# EasyEDA Pro project head_board.epro, schematic Schematic1
Board Name: Board1; Create Date: 2026-06-08; Page Name: P1; Project Name: AZIMOV Head; Schematic Name: Schematic1; Update Date: 2026-06-18; Company: EasyEDA.com; Page Size: A4; Version: V1.0
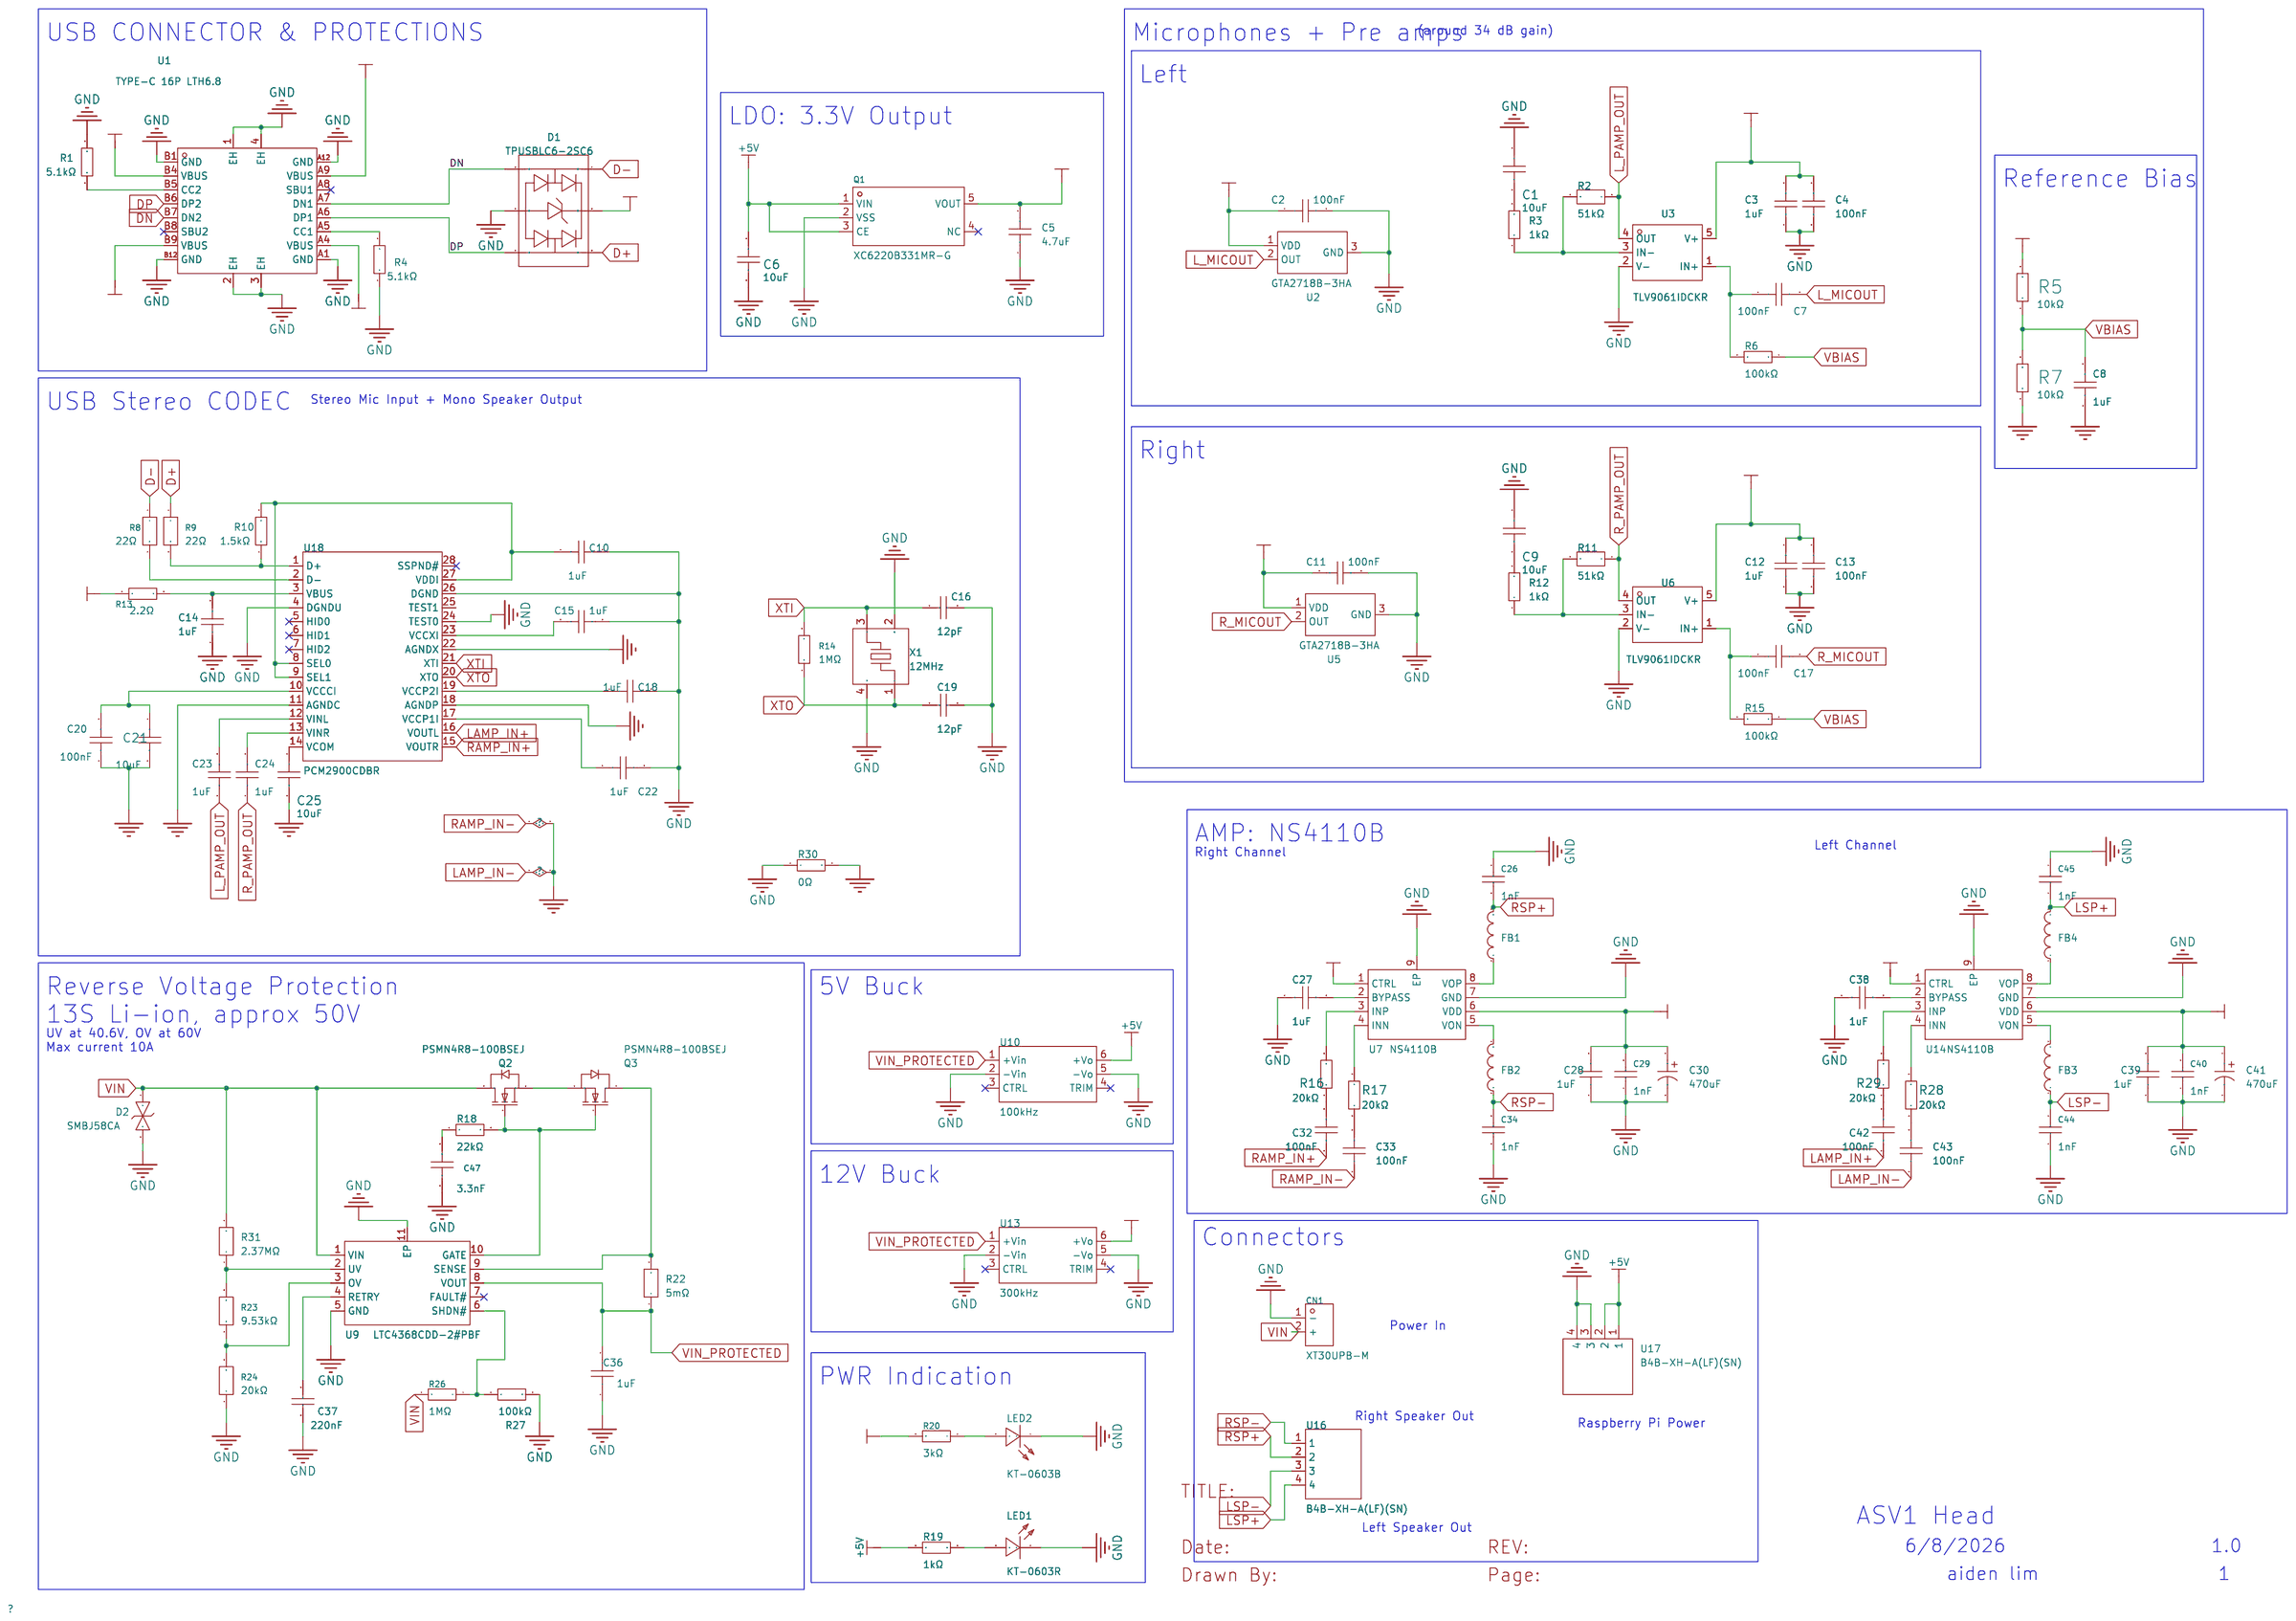
[diagram p0: schematic sheet]

## Parts
C1  10uF  [C0603]
C2  100nF  [C0603]
C3  1uF  [C0603]
C4  100nF  [C0603]
C5  4.7uF  [C0603]
C6  10uF  [C0603]
C7  100nF  [C0603]
C8  1uF  [C0603]
C9  10uF  [C0603]
C10  1uF  [C0603]
C11  100nF  [C0603]
C12  1uF  [C0603]
C13  100nF  [C0603]
C14  1uF  [C0603]
C15  1uF  [C0603]
C16  12pF  [C0603]
C17  100nF  [C0603]
C18  1uF  [C0603]
C19  12pF  [C0603]
C20  100nF  [C0603]
C21  10uF  [C0603]
C22  1uF  [C0603]
C23  1uF  [C0603]
C24  1uF  [C0603]
C25  10uF  [C0603]
C26  1nF  [C0603]
C27  1uF  [C0603]
C28  1uF  [C0603]
C29  1nF  [C0603]
C30  470uF  [CAP-TH_BD10.0-P5.00-D1.0-FD]
C32  100nF  [C0603]
C33  100nF  [C0603]
C34  1nF  [C0603]
C36  1uF  [C1206]
C37  220nF  [C0603]
C38  1uF  [C0603]
C39  1uF  [C0603]
C40  1nF  [C0603]
C41  470uF  [CAP-TH_BD10.0-P5.00-D1.0-FD]
C42  100nF  [C0603]
C43  100nF  [C0603]
C44  1nF  [C0603]
C45  1nF  [C0603]
C47  3.3nF  [C0603]
CN1  XT30UPB-M  [CONN-TH_XT30UPB-M]
D1  TPUSBLC6-2SC6  [SOT-23-6_L2.9-W1.6-P0.95-LS2.8-BR]
D2  SMBJ58CA  [SMB_L4.6-W3.6-LS5.4-BI]
FB1  BLM31PG601SN1L  [L1206]
FB2  BLM31PG601SN1L  [L1206]
FB3  BLM31PG601SN1L  [L1206]
FB4  BLM31PG601SN1L  [L1206]
LED1  KT-0603R  [LED0603-RD]
LED2  KT-0603B  [LED0603-RD]
Q1  XC6220B331MR-G  [SOT-25_L3.0-W1.6-P0.95-LS2.8-TL]
Q2  PSMN4R8-100BSEJ  [SOT404_L11.0-W10.0-P2.54-LS15.3-BR]
Q3  PSMN4R8-100BSEJ  [SOT404_L11.0-W10.0-P2.54-LS15.3-BR]
R1  5.1kΩ  [R0603]
R2  51kΩ  [R0603]
R3  1kΩ  [R0603]
R4  5.1kΩ  [R0603]
R5  10kΩ  [R0603]
R6  100kΩ  [R0603]
R7  10kΩ  [R0603]
R8  22Ω  [R0603]
R9  22Ω  [R0603]
R10  1.5kΩ  [R0603]
R11  51kΩ  [R0603]
R12  1kΩ  [R0603]
R13  2.2Ω  [R0603]
R14  1MΩ  [R0603]
R15  100kΩ  [R0603]
R16  20kΩ  [R0603]
R17  20kΩ  [R0603]
R18  22kΩ  [R0603]
R19  1kΩ  [R0603]
R20  3kΩ  [R0603]
R22  5mΩ  [RES-SMD_L6.4-W3.2_LR2512D-3W-1MR]
R23  9.53kΩ  [R0603]
R24  20kΩ  [R0805]
R26  1MΩ  [R0603]
R27  100kΩ  [R0603]
R28  20kΩ  [R0603]
R29  20kΩ  [R0603]
R30  0Ω  [R0603]
R31  2.37MΩ  [R0603]
U1  TYPE-C 16P LTH6.8  [USB-C-SMD_TYPE-C-16P-LTH6.8]
U2  GTA2718B-3HA  [MIC-SMD_3P-L2.8-W1.9_AP1688]
U3  TLV9061IDCKR  [SC-70-5_L2.1-W1.3-P0.65-LS2.2-BR]
U5  GTA2718B-3HA  [MIC-SMD_3P-L2.8-W1.9_AP1688]
U6  TLV9061IDCKR  [SC-70-5_L2.1-W1.3-P0.65-LS2.2-BR]
U7  NS4110B  [ESOP-8_L4.9-W3.9-P1.27-LS6.0-BL-EP-1]
U9  LTC4368CDD-2#PBF  [DFN-10_L3.0-W3.0-P0.50-BL-EP]
U10  100kHz  [PWRM-TH_TURBXXXXLD-30WR3]
U13  300kHz  [PWRM-TH_TURBXXXXLD-30WR3]
U14  NS4110B  [ESOP-8_L4.9-W3.9-P1.27-LS6.0-BL-EP-1]
U16  B4B-XH-A(LF)(SN)  [CONN-TH_B4B-XH-A-LF-SN]
U17  B4B-XH-A(LF)(SN)  [CONN-TH_B4B-XH-A-LF-SN]
U18  PCM2900CDBR  [SSOP-28_L10.2-W5.3-P0.65-LS7.8-BL]
X1  12MHz  [CRYSTAL-SMD_4P-L2.5-W2.0-BL-2]

## Library data of the parts
C1 C6 C9 C21 C25 = CL10A106MA8NRNC: Capacitance:10uF Tolerance:±20% Tolerance:±20% Voltage Rating:25V Temperature Coefficient:X5R; LCSC Part Name: 10uF ±20% 25V; Supplier Part: C96446; Manufacturer: SAMSUNG(三星); Supplier Footprint: 0603; JLCPCB Part Class: Basic Part; Datasheet: https://item.szlcsc.com/datasheet/CL10A106MA8NRNC/97651.html; Supplier: LCSC; Tolerance: ±20%; Voltage Rating: 25V; Temperature Coefficient: X5R
C2 C4 C7 C11 C13 C17 C20 C32 C33 C42 C43 = CC0603KRX7R9BB104: Capacitance:100nF Tolerance:±10% Tolerance:±10% Voltage Rating:50V Temperature Coefficient:X7R; LCSC Part Name: 100nF ±10% 50V; Supplier Part: C14663; Manufacturer: YAGEO(国巨); Supplier Footprint: 0603; JLCPCB Part Class: Basic Part; Datasheet: https://item.szlcsc.com/datasheet/CC0603KRX7R9BB104/15331.html; Supplier: LCSC; Tolerance: ±10%; Voltage Rating: 50V; Temperature Coefficient: X7R
C3 C8 C10 C12 C14 C15 C18 C22-C24 C27 C28 C38 C39 = CL10A105KB8NNNC: Capacitance:1uF Tolerance:±10% Tolerance:±10% Voltage Rating:50V Temperature Coefficient:X5R; LCSC Part Name: 1uF ±10% 50V; Supplier Part: C15849; Manufacturer: SAMSUNG(三星); Supplier Footprint: 0603; JLCPCB Part Class: Basic Part; Datasheet: https://item.szlcsc.com/datasheet/CL10A105KB8NNNC/16531.html; Supplier: LCSC; Tolerance: ±10%; Voltage Rating: 50V; Temperature Coefficient: X5R
C5 = CL10A475KO8NNNC: Capacitance:4.7uF Tolerance:±10% Tolerance:±10% Voltage Rating:16V Temperature Coefficient:X5R; LCSC Part Name: 4.7uF ±10% 16V; Supplier Part: C19666; Manufacturer: SAMSUNG(三星); Supplier Footprint: 0603; JLCPCB Part Class: Basic Part; Datasheet: https://item.szlcsc.com/datasheet/CL10A475KO8NNNC/20375.html; Supplier: LCSC; Tolerance: ±10%; Voltage Rating: 16V; Temperature Coefficient: X5R
C16 C19 = CL10C120JB8NNNC: Capacitance:12pF Tolerance:±5% Tolerance:±5% Voltage Rating:50V Temperature Coefficient:C0G; LCSC Part Name: 12pF ±5% 50V; Supplier Part: C38523; Manufacturer: SAMSUNG(三星); Supplier Footprint: 0603; JLCPCB Part Class: Basic Part; Datasheet: https://item.szlcsc.com/datasheet/CL10C120JB8NNNC/39506.html; Supplier: LCSC; Tolerance: ±5%; Voltage Rating: 50V; Temperature Coefficient: C0G
C26 C29 C34 C40 C44 C45 = CL10B102KB8NNNC: Capacitance:1nF Tolerance:±10% Tolerance:±10% Voltage Rating:50V Temperature Coefficient:X7R; LCSC Part Name: 1nF ±10% 50V; Supplier Part: C1588; Manufacturer: SAMSUNG(三星); Supplier Footprint: 0603; Datasheet: https://item.szlcsc.com/datasheet/CL10B102KB8NNNC/1940.html; Supplier: LCSC; Tolerance: ±10%; Voltage Rating: 50V; Temperature Coefficient: X7R
C30 C41 = KM477M035G17RR0VH2FP0: Capacitance:470uF Tolerance:±20% Tolerance:±20% Voltage Rating:35V Pin Spacing:5mm Diameter:10mm Height - Seated (Max):17mm Lifetime:2000hrs@105℃; LCSC Part Name: 470uF ±20% 35V; Supplier Part: C2064; Manufacturer: Chengx(承兴); Supplier Footprint: 插件,D10xL17mm; JLCPCB Part Class: Extended Part; Datasheet: https://item.szlcsc.com/datasheet/KM477M035G17RR0VH2FP0/2416.html; Supplier: LCSC; Tolerance: ±20%; Voltage Rating: 35V; Pin Spacing: 5mm; Diameter: 10mm; Height - Seated (Max): 17mm; Lifetime: 2000hrs@105℃
C36 = CC1206KKX7R0BB105: Capacitance:1uF Tolerance:±10% Tolerance:±10% Voltage Rating:100V Temperature Coefficient:X7R; LCSC Part Name: 1uF ±10% 100V; Supplier Part: C70463; Manufacturer: YAGEO(国巨); Supplier Footprint: 1206; Datasheet: https://item.szlcsc.com/datasheet/CC1206KKX7R0BB105/71560.html; Supplier: LCSC; Tolerance: ±10%; Voltage Rating: 100V; Temperature Coefficient: X7R
C37 = CL10B224KA8NNNC: Capacitance:220nF Tolerance:±10% Tolerance:±10% Voltage Rating:25V Temperature Coefficient:X7R; LCSC Part Name: 220nF ±10% 25V; Supplier Part: C21120; Manufacturer: SAMSUNG(三星); Supplier Footprint: 0603; JLCPCB Part Class: Basic Part; Datasheet: https://item.szlcsc.com/datasheet/CL10B224KA8NNNC/21832.html; Supplier: LCSC; Tolerance: ±10%; Voltage Rating: 25V; Temperature Coefficient: X7R
C47 = 0603B332K101CT: Capacitance:3.3nF Tolerance:±10% Tolerance:±10% Voltage Rating:100V Temperature Coefficient:X7R; LCSC Part Name: 3.3nF ±10% 100V; Supplier Part: C388015; Manufacturer: Walsin(华新科); Supplier Footprint: 0603; JLCPCB Part Class: Extended Part; Datasheet: https://item.szlcsc.com/datasheet/0603B332K101CT/362276.html; Supplier: LCSC; Tolerance: ±10%; Voltage Rating: 100V; Temperature Coefficient: X7R
CN1 = XT30UPB-M: Rated current:15A Rated voltage: colour:Yellow Connector type:Model aircraft plug contact resistance: interface form:Male insulating material: metal material:Gold plating; LCSC Part Name: AMASS(艾迈斯)板载立式 航模锂电池控制器连接器插头 PCB板立式 公头XT30UPB-M.G.Y; Supplier Part: C428721; Manufacturer: AMASS(艾迈斯); JLCPCB Part Class: Extended Part; Datasheet: https://item.szlcsc.com/datasheet/XT30UPB-M/423831.html; Supplier: LCSC; Rated current: 15A; colour: Yellow; Connector type: Model aircraft plug; interface form: Male; metal material: Gold plating
D1 = TPUSBLC6-2SC6: Supplier Part: C558442; Manufacturer: TECH PUBLIC(台舟); Supplier Footprint: SOT-23-6; JLCPCB Part Class: Extended Part; Datasheet: https://atta.szlcsc.com/upload/public/pdf/source/20210810/11DFA42F7286E2AE9C51365C4E40A67A.pdf; Supplier: LCSC
D2 = SMBJ58CA_C19077592: Polarity:Bidirectional Reverse Stand-Off Voltage (Vrwm):58V Clamping Voltage:93.6V Peak Pulse Current (Ipp):6.41A@10/1000us Peak Pulse Power Dissipation (Ppp):600W@10/1000us Voltage - Breakdown:71.2V Reverse Leakage Current (Ir):5uA Operating Temperature:; LCSC Part Name: 双向TVS 58V截止 峰值浪涌电流：6.41A@10/1000us; Supplier Part: C19077592; Manufacturer: R+O(宏嘉诚); Supplier Footprint: DO-214AA(SMB); Datasheet: https://item.szlcsc.com/datasheet/SMBJ58CA/20275677.html; Supplier: LCSC; Polarity: Bidirectional; Reverse Stand-Off Voltage (Vrwm): 58V; Clamping Voltage: 93.6V; Peak Pulse Current (Ipp): 6.41A@10/1000us; Peak Pulse Power Dissipation (Ppp): 600W@10/1000us; Voltage - Breakdown: 71.2V; Reverse Leakage Current (Ir): 5uA; Operating Temperature: -55℃~+150℃; level of protection: IEC 61000-4-2; Type: TVS
FB1-FB4 = BLM31PG601SN1L: Impedance @ Frequency:600Ω@100MHz Tolerance:±25% Tolerance:±25% DC Resistance(DCR):80mΩ Current Rating:1.5A Number of Circuits:1 Operating Temperature:-55℃~+125℃ Operating Temperature:-55℃~+125℃; LCSC Part Name: 单路 1206磁珠 阻抗600Ω@100MHz; Supplier Part: C16902; Manufacturer: muRata(村田); Supplier Footprint: 1206; JLCPCB Part Class: Extended Part; Datasheet: https://item.szlcsc.com/datasheet/BLM31PG601SN1L/17586.html; Supplier: LCSC; Impedance @ Frequency: 600Ω@100MHz; Tolerance: ±25%; DC Resistance(DCR): 80mΩ; Current Rating: 1.5A; Number of Circuits: 1; Operating Temperature: -55℃~+125℃
LED1 = KT-0603R: Emitted Color:Red Power Dissipation:- Forward Current:- Dominant Wavelength:- Dominant Wavelength:- Peak Wavelength:- Diode Configuration:- Lens Color:- Color Temperature:- Color Temperature:- Viewing Angle:- Mounting Sytle:- Operating Temperature:-40℃~+8; LCSC Part Name: 0603 红灯 高亮; Supplier Part: C2286; Manufacturer: KENTO; Supplier Footprint: 0603; JLCPCB Part Class: Basic Part; Datasheet: https://atta.szlcsc.com/upload/public/pdf/source/20160616/1466072038404.pdf; Supplier: LCSC; Emitted Color: Red; Operating Temperature: -40℃~+85℃
LED2 = KT-0603B: Lamp Holder Type:1.6mm x 0.8mm square LED Illumination Color:Blue Voltage - Forward(Vf):3.1V Voltage - Forward(Vf):3.1V Power(Watts):100mW Forward Current:5mA Wavelength - Dominant:460nm~475nm Wavelength - Dominant:460nm~475nm Peak Wavelength:469nm Peak W; LCSC Part Name: 0603 蓝灯 高亮; Supplier Part: C2288; Manufacturer: KENTO; Supplier Footprint: 0603; Datasheet: https://item.szlcsc.com/datasheet/KT-0603B/2661.html; Supplier: LCSC; Lamp Holder Type: 1.6mm x 0.8mm square LED; Illumination Color: Blue; Voltage - Forward(Vf): 3.1V; Power(Watts): 100mW; Forward Current: 5mA; Wavelength - Dominant: 460nm~475nm; Peak Wavelength: 469nm; Diode Configuration: Discrete Diode; Lens Color: Water Clear; Luminous Intensity: 175mcd; Viewing Angle: 120°; Operating Temperature: -40℃~+85℃
Q1 = XC6220B331MR-G: Output Type:Fixed Voltage - Supply:6V Output Voltage:3.3V Output Voltage:3.3V Output Current:1A Power Supply Rejection Ratio (PSRR):50dB@(1kHz) Voltage Dropout:655mV@(1A) standby current:8uA Features:Over Current Protection；Enable；Over Temperature Protect; LCSC Part Name: 输入6V 输出3.3V 1A 带\"GO\"功能的高速LDO电压稳压器; Supplier Part: C86534; Manufacturer: TOREX(特瑞仕); Supplier Footprint: SOT-25; JLCPCB Part Class: Extended Part; Datasheet: https://item.szlcsc.com/datasheet/XC6220B331MR-G/87711.html; Supplier: LCSC; Output Type: Fixed; Voltage - Supply: 6V; Output Voltage: 3.3V; Output Current: 1A; Power Supply Rejection Ratio (PSRR): 50dB@(1kHz); Voltage Dropout: 655mV@(1A); standby current: 8uA; Features: Over Current Protection；Enable；Over Temperature Protection；Short Circuit Protection; Operating Temperature: -40℃~+85℃; Output Configuration: Positive; Number of Outputs: 1
Q2 Q3 = PSMN4R8-100BSEJ_C458260: Number:1 N-Channel Drain to Source Voltage:100V Current - Continuous Drain(Id):120A RDS(on):4.8mΩ@10V,25A Pd - Power Dissipation:405W Gate Threshold Voltage (Vgs(th)):3V Gate Charge(Qg):278nC@10V Input Capacitance(Ciss):14.4nF@50V Reverse Transfer Capacit; LCSC Part Name: 1个N沟道 耐压:100V 电流:120A; Supplier Part: C458260; Manufacturer: Nexperia(安世); Supplier Footprint: D2PAK; JLCPCB Part Class: Extended Part; Datasheet: https://item.szlcsc.com/datasheet/PSMN4R8-100BSEJ/462079.html; Supplier: LCSC; Number: 1 N-Channel; Drain to Source Voltage: 100V; Current - Continuous Drain(Id): 120A; RDS(on): 4.8mΩ@10V,25A; Pd - Power Dissipation: 405W; Gate Threshold Voltage (Vgs(th)): 3V; Gate Charge(Qg): 278nC@10V; Input Capacitance(Ciss): 14.4nF@50V; Reverse Transfer Capacitance (Crss@Vds): 643pF@50V; Operating Temperature: -55℃~+175℃
R1 R4 = 0603WAF5101T5E: Type:Thick Film Resistor Resistance:5.1kΩ Tolerance:±1% Tolerance:±1% Power(Watts):100mW Voltage-Supply(Max):75V Temperature Coefficient:±100ppm/℃ Temperature Coefficient:±100ppm/℃ Operating Temperature:-55℃~+155℃ Operating Temperature:-55℃~+155℃; LCSC Part Name: 5.1kΩ ±1% 100mW 厚膜电阻; Supplier Part: C23186; Manufacturer: UNI-ROYAL(厚声); Supplier Footprint: 0603; JLCPCB Part Class: Basic Part; Datasheet: https://item.szlcsc.com/datasheet/0603WAF5101T5E/23913.html; Supplier: LCSC; Type: Thick Film Resistor; Tolerance: ±1%; Power(Watts): 100mW; Voltage-Supply(Max): 75V; Temperature Coefficient: ±100ppm/℃; Operating Temperature: -55℃~+155℃
R2 R11 = CR0603F51K0P05Z: Type:Thick Film Resistor Resistance:51kΩ Tolerance:±1% Tolerance:±1% Power(Watts):100mW Voltage-Supply(Max):75V Temperature Coefficient:±100ppm/℃ Temperature Coefficient:±100ppm/℃ Operating Temperature:-55℃~+155℃ Operating Temperature:-55℃~+155℃; LCSC Part Name: 厚膜电阻 51kΩ ±1% 100mW; Supplier Part: C881264; Manufacturer: EVER OHMS(天二科技); Supplier Footprint: 0603; JLCPCB Part Class: Extended Part; Datasheet: https://item.szlcsc.com/datasheet/CR0603F51K0P05Z/944179.html; Supplier: LCSC; Type: Thick Film Resistor; Tolerance: ±1%; Power(Watts): 100mW; Voltage-Supply(Max): 75V; Temperature Coefficient: ±100ppm/℃; Operating Temperature: -55℃~+155℃
R3 R12 = 0603WAF1001T5E: Type:Thick Film Resistor Resistance:1kΩ Tolerance:±1% Tolerance:±1% Power(Watts):100mW Voltage-Supply(Max):75V Temperature Coefficient:±100ppm/℃ Temperature Coefficient:±100ppm/℃ Operating Temperature:-55℃~+155℃ Operating Temperature:-55℃~+155℃; LCSC Part Name: 1kΩ ±1% 100mW 厚膜电阻; Supplier Part: C21190; Manufacturer: UNI-ROYAL(厚声); Supplier Footprint: 0603; Datasheet: https://item.szlcsc.com/datasheet/0603WAF1001T5E/21904.html; Supplier: LCSC; Type: Thick Film Resistor; Tolerance: ±1%; Power(Watts): 100mW; Voltage-Supply(Max): 75V; Temperature Coefficient: ±100ppm/℃; Operating Temperature: -55℃~+155℃
R5 R7 = RT0603BRD0710KL: Type:Thin Film Resistor Resistance:10kΩ Tolerance:±0.1% Tolerance:±0.1% Power(Watts):100mW Voltage-Supply(Max):75V Temperature Coefficient:±25ppm/℃ Temperature Coefficient:±25ppm/℃ Operating Temperature:-55℃~+155℃ Operating Temperature:-55℃~+155℃; LCSC Part Name: 薄膜电阻 10kΩ ±0.1% 100mW; Supplier Part: C95204; Manufacturer: YAGEO(国巨); Supplier Footprint: 0603; JLCPCB Part Class: Extended Part; Datasheet: https://item.szlcsc.com/datasheet/RT0603BRD0710KL/96405.html; Supplier: LCSC; Type: Thin Film Resistor; Tolerance: ±0.1%; Power(Watts): 100mW; Voltage-Supply(Max): 75V; Temperature Coefficient: ±25ppm/℃; Operating Temperature: -55℃~+155℃
R6 R15 R27 = 0603WAF1003T5E: Type:Thick Film Resistor Resistance:100kΩ Tolerance:±1% Tolerance:±1% Power(Watts):100mW Voltage-Supply(Max):75V Temperature Coefficient:±100ppm/℃ Temperature Coefficient:±100ppm/℃ Operating Temperature:-55℃~+155℃ Operating Temperature:-55℃~+155℃; LCSC Part Name: 100kΩ ±1% 100mW 厚膜电阻; Supplier Part: C25803; Manufacturer: UNI-ROYAL(厚声); Supplier Footprint: 0603; JLCPCB Part Class: Basic Part; Datasheet: https://item.szlcsc.com/datasheet/0603WAF1003T5E/26546.html; Supplier: LCSC; Type: Thick Film Resistor; Tolerance: ±1%; Power(Watts): 100mW; Voltage-Supply(Max): 75V; Temperature Coefficient: ±100ppm/℃; Operating Temperature: -55℃~+155℃
R8 R9 = ERJPA3J220V: Type:Thick Film Resistors Resistance: Tolerance:±5% Tolerance:±5% Power(Watts):333mW Overload Voltage (Max):- Temperature Coefficient:±200ppm/℃ Temperature Coefficient:±200ppm/℃ Operating Temperature Range:-55℃~+155℃ Operating Temperature Range:-55℃~+155℃; LCSC Part Name: 22Ω ±5% 333mW 厚膜电阻; Supplier Part: C441880; Manufacturer: PANASONIC(松下); Supplier Footprint: 0603; JLCPCB Part Class: Extended Part; Supplier: LCSC; Type: Thick Film Resistors; Tolerance: ±5%; Power(Watts): 333mW; Temperature Coefficient: ±200ppm/℃; Operating Temperature Range: -55℃~+155℃
R10 = 0603WAF1501T5E: Type:Thick Film Resistor Resistance:1.5kΩ Tolerance:±1% Tolerance:±1% Power(Watts):100mW Voltage-Supply(Max):75V Temperature Coefficient:±100ppm/℃ Temperature Coefficient:±100ppm/℃ Operating Temperature:-55℃~+155℃ Operating Temperature:-55℃~+155℃; LCSC Part Name: 1.5kΩ ±1% 100mW 厚膜电阻; Supplier Part: C22843; Manufacturer: UNI-ROYAL(厚声); Supplier Footprint: 0603; Datasheet: https://item.szlcsc.com/datasheet/0603WAF1501T5E/23570.html; Supplier: LCSC; Type: Thick Film Resistor; Tolerance: ±1%; Power(Watts): 100mW; Voltage-Supply(Max): 75V; Temperature Coefficient: ±100ppm/℃; Operating Temperature: -55℃~+155℃
R13 = 0603WAF220KT5E: Type:Thick Film Resistor Resistance:2.2Ω Tolerance:±1% Tolerance:±1% Power(Watts):100mW Voltage-Supply(Max):75V Temperature Coefficient:±400ppm/℃ Temperature Coefficient:±400ppm/℃ Operating Temperature:-55℃~+155℃ Operating Temperature:-55℃~+155℃; LCSC Part Name: 2.2Ω ±1% 100mW 厚膜电阻; Supplier Part: C22939; Manufacturer: UNI-ROYAL(厚声); Supplier Footprint: 0603; Datasheet: https://item.szlcsc.com/datasheet/0603WAF220KT5E/23666.html; Supplier: LCSC; Type: Thick Film Resistor; Tolerance: ±1%; Power(Watts): 100mW; Voltage-Supply(Max): 75V; Temperature Coefficient: ±400ppm/℃; Operating Temperature: -55℃~+155℃
R14 R26 = 0603WAF1004T5E: Type:Thick Film Resistor Resistance:1MΩ Tolerance:±1% Tolerance:±1% Power(Watts):100mW Voltage-Supply(Max):75V Temperature Coefficient:±100ppm/℃ Temperature Coefficient:±100ppm/℃ Operating Temperature:-55℃~+155℃ Operating Temperature:-55℃~+155℃; LCSC Part Name: 1MΩ ±1% 100mW 厚膜电阻; Supplier Part: C22935; Manufacturer: UNI-ROYAL(厚声); Supplier Footprint: 0603; JLCPCB Part Class: Basic Part; Datasheet: https://item.szlcsc.com/datasheet/0603WAF1004T5E/23662.html; Supplier: LCSC; Type: Thick Film Resistor; Tolerance: ±1%; Power(Watts): 100mW; Voltage-Supply(Max): 75V; Temperature Coefficient: ±100ppm/℃; Operating Temperature: -55℃~+155℃
R16 R17 R28 R29 = 0603WAF2002T5E: Type:Thick Film Resistor Resistance:20kΩ Tolerance:±1% Tolerance:±1% Power(Watts):100mW Voltage-Supply(Max):75V Temperature Coefficient:±100ppm/℃ Temperature Coefficient:±100ppm/℃ Operating Temperature:-55℃~+155℃ Operating Temperature:-55℃~+155℃; LCSC Part Name: 20kΩ ±1% 100mW 厚膜电阻; Supplier Part: C4184; Manufacturer: UNI-ROYAL(厚声); Supplier Footprint: 0603; JLCPCB Part Class: Basic Part; Datasheet: https://item.szlcsc.com/datasheet/0603WAF2002T5E/4591.html; Supplier: LCSC; Type: Thick Film Resistor; Tolerance: ±1%; Power(Watts): 100mW; Voltage-Supply(Max): 75V; Temperature Coefficient: ±100ppm/℃; Operating Temperature: -55℃~+155℃
R18 = 0603WAF2202T5E: Type:Thick Film Resistor Resistance:22kΩ Tolerance:±1% Tolerance:±1% Power(Watts):100mW Voltage-Supply(Max):75V Temperature Coefficient:±100ppm/℃ Temperature Coefficient:±100ppm/℃ Operating Temperature:-55℃~+155℃ Operating Temperature:-55℃~+155℃; LCSC Part Name: 22kΩ ±1% 100mW 厚膜电阻; Supplier Part: C31850; Manufacturer: UNI-ROYAL(厚声); Supplier Footprint: 0603; JLCPCB Part Class: Basic Part; Datasheet: https://item.szlcsc.com/datasheet/0603WAF2202T5E/32812.html; Supplier: LCSC; Type: Thick Film Resistor; Tolerance: ±1%; Power(Watts): 100mW; Voltage-Supply(Max): 75V; Temperature Coefficient: ±100ppm/℃; Operating Temperature: -55℃~+155℃
R19 = 0603WAF1001T5E: Type:Thick Film Resistor Resistance:1kΩ Tolerance:±1% Tolerance:±1% Power(Watts):100mW Voltage-Supply(Max):75V Temperature Coefficient:±100ppm/℃ Temperature Coefficient:±100ppm/℃ Operating Temperature:-55℃~+155℃ Operating Temperature:-55℃~+155℃; LCSC Part Name: 1kΩ ±1% 100mW 厚膜电阻; Supplier Part: C21190; Manufacturer: UNI-ROYAL(厚声); Supplier Footprint: 0603; JLCPCB Part Class: Basic Part; Datasheet: https://item.szlcsc.com/datasheet/0603WAF1001T5E/21904.html; Supplier: LCSC; Type: Thick Film Resistor; Tolerance: ±1%; Power(Watts): 100mW; Voltage-Supply(Max): 75V; Temperature Coefficient: ±100ppm/℃; Operating Temperature: -55℃~+155℃
R20 = 0603WAF3001T5E: Type:Thick Film Resistor Resistance:3kΩ Tolerance:±1% Tolerance:±1% Power(Watts):100mW Voltage-Supply(Max):75V Temperature Coefficient:±100ppm/℃ Temperature Coefficient:±100ppm/℃ Operating Temperature:-55℃~+155℃ Operating Temperature:-55℃~+155℃; LCSC Part Name: 3kΩ ±1% 100mW 厚膜电阻; Supplier Part: C4211; Manufacturer: UNI-ROYAL(厚声); Supplier Footprint: 0603; JLCPCB Part Class: Basic Part; Datasheet: https://item.szlcsc.com/datasheet/0603WAF3001T5E/4618.html; Supplier: LCSC; Type: Thick Film Resistor; Tolerance: ±1%; Power(Watts): 100mW; Voltage-Supply(Max): 75V; Temperature Coefficient: ±100ppm/℃; Operating Temperature: -55℃~+155℃
R22 = PCSR2512BR005M6: Type:Current Sense Resistor Resistance:5mΩ Tolerance:±0.1% Tolerance:±0.1% Voltage Rating:- Power(Watts):2W Current Rating:- Temperature Coefficient:±15ppm/℃ Temperature Coefficient:±15ppm/℃ Mounting Type:Surface Mount; LCSC Part Name: 采样电阻 5mΩ ±0.1% 2W; Supplier Part: C48982662; Manufacturer: RESI(开步睿思); Supplier Footprint: 2512; JLCPCB Part Class: Extended Part; Datasheet: https://item.szlcsc.com/datasheet/PCSR2512BR005M6/51314565.html; Supplier: LCSC; Type: Current Sense Resistor; Tolerance: ±0.1%; Power(Watts): 2W; Temperature Coefficient: ±15ppm/℃; Mounting Type: Surface Mount
R23 = ERJ3EKF9531V: Type:Thick Film Resistor Resistance:9.53kΩ Tolerance:±1% Tolerance:±1% Power(Watts):100mW Voltage-Supply(Max):75V Temperature Coefficient:±100ppm/℃ Temperature Coefficient:±100ppm/℃ Operating Temperature:-55℃~+155℃ Operating Temperature:-55℃~+155℃; LCSC Part Name: 9.53kΩ ±1% 100mW 厚膜电阻; Supplier Part: C403403; Manufacturer: PANASONIC(松下); Supplier Footprint: 0603; JLCPCB Part Class: Extended Part; Datasheet: https://item.szlcsc.com/datasheet/ERJ3EKF9531V/389202.html; Supplier: LCSC; Type: Thick Film Resistor; Tolerance: ±1%; Power(Watts): 100mW; Voltage-Supply(Max): 75V; Temperature Coefficient: ±100ppm/℃; Operating Temperature: -55℃~+155℃
R24 = 0805W8F2002T5E: Type:Thick Film Resistors Resistance:20kΩ Tolerance:±1% Tolerance:±1% Power(Watts): Overload Voltage (Max): Temperature Coefficient:±100ppm/℃ Temperature Coefficient:±100ppm/℃ Operating Temperature Range:-55℃~+155℃ Operating Temperature Range:-55℃~+155℃; LCSC Part Name: 20kΩ ±1% 125mW 厚膜电阻; Supplier Part: C4328; Manufacturer: UNI-ROYAL(厚声); Supplier Footprint: 0805; JLCPCB Part Class: Basic Part; Datasheet: https://atta.szlcsc.com/upload/public/pdf/source/20200306/C422600_1E6D84923E4A46A82E41ADD87F860B5C.pdf; Supplier: LCSC; Type: Thick Film Resistors; Tolerance: ±1%; Temperature Coefficient: ±100ppm/℃; Operating Temperature Range: -55℃~+155℃
R30 = ERJ3GEY0R00V: Type:Thick Film Resistor Resistance:0Ω Tolerance:- Tolerance:- Power(Watts):100mW Voltage-Supply(Max):150V Temperature Coefficient:- Temperature Coefficient:- Operating Temperature:-55℃~+155℃ Operating Temperature:-55℃~+155℃; LCSC Part Name: 0Ω 100mW 厚膜电阻; Supplier Part: C122704; Manufacturer: PANASONIC(松下); Supplier Footprint: 0603; JLCPCB Part Class: Extended Part; Datasheet: https://item.szlcsc.com/datasheet/ERJ3GEY0R00V/123974.html; Supplier: LCSC; Type: Thick Film Resistor; Power(Watts): 100mW; Voltage-Supply(Max): 150V; Operating Temperature: -55℃~+155℃
R31 = WR06W2374FTL: Type:Thick Film Resistors Resistance: Tolerance:±1% Tolerance:±1% Power(Watts): Overload Voltage (Max): Temperature Coefficient:±100ppm/℃ Temperature Coefficient:±100ppm/℃ Operating Temperature Range:-55℃~+155℃ Operating Temperature Range:-55℃~+155℃; LCSC Part Name: 厚膜电阻 2.37MΩ ±1% 100mW; Supplier Part: C367737; Manufacturer: Walsin(华新科); Supplier Footprint: 0603; JLCPCB Part Class: Extended Part; Datasheet: https://atta.szlcsc.com/upload/public/pdf/source/20191217/C470037_D99261402F77DA8B1D609223749D445A.pdf; Supplier: LCSC; Type: Thick Film Resistors; Tolerance: ±1%; Temperature Coefficient: ±100ppm/℃; Operating Temperature Range: -55℃~+155℃
U1 = TYPE-C 16P LTH6.8: Connector Type:Type-C Protocol Standard:USB 3.1 Gender:Female Mounting Type:Surface Mount,Vertical Number of Contacts:16P Number of Ports:1 Current Rating-Power:5A Voltage Rating:20V Connect-Disconnect Life:10,000 Cycles Detection color:Black Operating Te; LCSC Part Name: Type-C 母 立贴; Supplier Part: C5187468; Manufacturer: SHOU HAN(首韩); Supplier Footprint: SMD; Datasheet: https://item.szlcsc.com/datasheet/TYPE-C%252016P%2520LTH6.8/5860363.html; Supplier: LCSC; Connector Type: Type-C; Protocol Standard: USB 3.1; Gender: Female; Mounting Type: Surface Mount,Vertical; Number of Contacts: 16P; Number of Ports: 1; Current Rating-Power: 5A; Voltage Rating: 20V; Connect-Disconnect Life: 10,000 Cycles; Detection color: Black; Operating Temperature: -40℃~+85℃
U2 U5 = GTA2718B-3HA: Direction:Omnidirectional Voltage - Supply:2.3V~3.6V Voltage - Supply:2.3V~3.6V Current Consumption:135uA Current Consumption:135uA S/N Ratio:66dB Sensitivity:-38dB Sensitivity:-38dB Impedance:400Ω Output Type:Analog output Length:2.75mm Width:1.85mm Heig; LCSC Part Name: 2718模拟bottom MEMS; Supplier Part: C50275773; Manufacturer: Gettop(共达); Supplier Footprint: SMD; Datasheet: https://item.szlcsc.com/datasheet/GTA2718B-3HA/52862125.html; Supplier: LCSC; Direction: Omnidirectional; Voltage - Supply: 2.3V~3.6V; Current Consumption: 135uA; S/N Ratio: 66dB; Sensitivity: -38dB; Impedance: 400Ω; Output Type: Analog output; Length: 2.75mm; Width: 1.85mm; Height: 1mm; Operating Temperature: -40℃~+85℃
U3 U6 = TLV9061IDCKR: Number of Channels:1 Maximum Power Supply Range (Vdd-Vss):9V Rail to Rail:Rail-to-Rail Input, Rail-to-Rail Output Gain Bandwidth Product:10MHz Vos - Input Offset Voltage:1.6mV Input Offset Voltage Drift(Vos TC):530nV/℃ Slew Rate:55V/us Ib - Input Bias Cur; LCSC Part Name: 适用于成本敏感型系统的10MHz、轨到轨输入输出（RRIO）CMOS运算放大器; Supplier Part: C398357; Manufacturer: TI(德州仪器); Supplier Footprint: SC-70-5; Datasheet: https://www.ti.com/cn/lit/gpn/tlv9061; Supplier: LCSC; Number of Channels: 1; Maximum Power Supply Range (Vdd-Vss): 9V; Rail to Rail: Rail-to-Rail Input, Rail-to-Rail Output; Gain Bandwidth Product: 10MHz; Vos - Input Offset Voltage: 1.6mV; Input Offset Voltage Drift(Vos TC): 530nV/℃; Slew Rate: 55V/us; Ib - Input Bias Current: 0.5pA; Input Offset Current(Ios): 0.05pA; Input Voltage Noise Density: 10nV/√Hz@10kHz; Common Mode Rejection Ratio(CMRR): 103dB; Quiescent Current: 538uA; Output Current: 50mA; Operating Temperature: -40℃~+125℃; Single supply: 1.8V~5.5V; Features: Enable/shutdown function；ESD protection；EMI filtering/RF suppression
U7 U14 = NS4110B_C5334145: Class:- Speaker Channels:- Output Power:18Wx1@4Ω Voltage - Supply:6V~14V Voltage - Supply:6V~14V Total Harmonic Distortion + Noise (THD+N):- Quiescent Current:- Operating Temperature:- Operating Temperature:-; LCSC Part Name: 18W 单声道AB/D类双模音频功率放大器; Supplier Part: C5334145; Manufacturer: Nsiway(纳芯威); Supplier Footprint: eSOP-8; Datasheet: https://atta.szlcsc.com/upload/public/pdf/source/20190704/C189954_B30928FB64DD6661E441E2B3274B0355.pdf; Supplier: LCSC; Output Power: 18Wx1@4Ω; Voltage - Supply: 6V~14V
U9 = LTC4368CDD-2#PBF: Number of Lines:1 Mounting Type:-; LCSC Part Name: 100V UV/OV和反向保护控制器，带双向断路器; Supplier Part: C688382; Manufacturer: ADI(亚德诺); Supplier Footprint: DFN-10-EP(3x3); Datasheet: https://item.szlcsc.com/datasheet/LTC4368CDD-2%2523PBF/719090.html; Supplier: LCSC; Number of Lines: 1
U10 = URB4805LD-30WR3_C20199272: Number of Outputs:1 Output Power:30W Voltage - Supply:75V Voltage - Supply:75V Conversion Efficiency:87% Conversion Efficiency:87% Output Voltage:5V Output Voltage:5V Output Current(Max):6A Output Current(Max):6A Isolation Voltage(Vrms):1.5kV Operating Te; LCSC Part Name: 物联网模组和AloT物联网整体解决方案; Supplier Part: C20199272; Manufacturer: HI-LINK(海凌科); Manufacturer Part: URB4805LD-30WR3; Supplier Footprint: 插件,50.8x25.4mm; JLCPCB Part Class: Extended Part; Datasheet: https://item.szlcsc.com/datasheet/URB4805LD-30WR3/21524469.html; Supplier: LCSC; Number of Outputs: 1; Output Power: 30W; Voltage - Supply: 75V; Conversion Efficiency: 87%; Output Voltage: 5V; Output Current(Max): 6A; Isolation Voltage(Vrms): 1.5kV; Operating Temperature: -40℃~+80℃; Length: 50.8mm; Width: 25.4mm; Height: 11.8mm
U13 = URB4805LD-30WR3_C20199272: Number of Outputs:1 Output Power:30W Voltage - Supply:75V Voltage - Supply:75V Conversion Efficiency:87% Conversion Efficiency:87% Output Voltage:5V Output Voltage:5V Output Current(Max):6A Output Current(Max):6A Isolation Voltage(Vrms):1.5kV Operating Te; LCSC Part Name: 物联网模组和AloT物联网整体解决方案; Supplier Part: C20199274; Manufacturer: HI-LINK(海凌科); Manufacturer Part: URB4812LD-30WR3; Supplier Footprint: 插件,50.8x25.4mm; JLCPCB Part Class: Extended Part; Datasheet: https://item.szlcsc.com/datasheet/URB4805LD-30WR3/21524469.html; Supplier: LCSC; Number of Outputs: 1; Output Power: 30W; Voltage - Supply: 75V; Conversion Efficiency: 87%; Output Voltage: 12V; Output Current(Max): 2.5; Isolation Voltage(Vrms): 1.5kV; Operating Temperature: -40℃~+80℃; Length: 50.8mm; Width: 25.4mm; Height: 11.8mm
U16 U17 = B4B-XH-A(LF)(SN): Pins Structure:1x4P Pitch:2.5mm Mounting Type:Through Hole Reference Series:XH Number of Pins:4P Number of Rows:1 Number of PINs Per Row:4 Row Spacing:- Current Rating:3A Contact Material:Brass Contact Plating:Tin Operating Temperature:-25℃~+85℃ Operating; LCSC Part Name: 1x4P 间距:2.5mm 直插 系列:XH; Supplier Part: C144395; Manufacturer: JST; Supplier Footprint: 插件,P=2.5mm; JLCPCB Part Class: Extended Part; Datasheet: https://item.szlcsc.com/datasheet/B4B-XH-A(LF)(SN)/155727.html; Supplier: LCSC; Pins Structure: 1x4P; Pitch: 2.5mm; Mounting Type: Through Hole; Reference Series: XH; Number of Pins: 4P; Number of Rows: 1; Number of PINs Per Row: 4; Current Rating: 3A; Contact Material: Brass; Contact Plating: Tin; Operating Temperature: -25℃~+85℃; Voltage Rating: 250V; Plastic Material: PA66; Flame Retardant Rating: UL94V-0; Supplementary Features: K Pin; Color: White; Z-Height of the Board: 7mm; X-Length of Bottom Edge on Board (Spacing Line): 12.4mm; Y-Width of Bottom Edge on Board: 5.75mm
U18 = PCM2900CDBR: Type:Codec Interface:USB Sampling Rate:8kHz~48kHz Sampling Rate:8kHz~48kHz Voltage - Supply:4.35V~5.25V Voltage - Supply:4.35V~5.25V Operating Temperature:-25℃~+85℃ Operating Temperature:-25℃~+85℃; LCSC Part Name: 立体声音频编解码器，带USB接口; Supplier Part: C180425; Manufacturer: TI(德州仪器); Supplier Footprint: SSOP-28-208mil; JLCPCB Part Class: Extended Part; Datasheet: https://www.ti.com/cn/lit/gpn/pcm2900c; Supplier: LCSC; Type: Codec; Interface: USB; Sampling Rate: 8kHz~48kHz; Voltage - Supply: 4.35V~5.25V; Operating Temperature: -25℃~+85℃
X1 = Y252012MEBCX: Type:Crystal Oscillator Frequency:12MHz Normal temperature Frequency Tolerance:±10ppm Normal temperature Frequency Tolerance:±10ppm Load Capacitance:10pF Frequency Stability:±20ppm Frequency Stability:±20ppm Operating Temperature:-40℃~+85℃ Operating Tempe; LCSC Part Name: 2520 12MHZ 10PF ±10PPM; Supplier Part: C49158138; Manufacturer: JLYE(晶力源); Supplier Footprint: SMD2520-4P; JLCPCB Part Class: Extended Part; Datasheet: https://item.szlcsc.com/datasheet/Y252012MEBCX/51546171.html; Supplier: LCSC; Type: Crystal Oscillator; Normal temperature Frequency Tolerance: ±10ppm; Load Capacitance: 10pF; Frequency Stability: ±20ppm; Operating Temperature: -40℃~+85℃

## Nets
+3.3V: C2.1 C3.2 C4.1 C5.2 C11.1 C12.2 C13.1 Q1.5(VOUT) R5.2 U2.1(VDD) U3.5(V+) U5.1(VDD) U6.5(V+) U7.1(CTRL) U14.1(CTRL)
+5V: C6.1 Q1.1(VIN) Q1.3(CE) R19.1 U10.6(+Vo) U17.1 U17.2
+12V: C28.2 C29.2 C30.1 C39.2 C40.2 C41.1 R20.2 U7.6(VDD) U13.6(+Vo) U14.6(VDD)
AGND: C8.1 C20.1 C21.2 C25.2 C33.1 C43.1 R7.1 R30.2 U18.11(AGNDC) U18.18(AGNDP) U18.22(AGNDX)
GND: C1.1 C2.2 C3.1 C4.2 C5.1 C6.2 C9.1 C10.2 C11.2 C12.1 C13.2 C14.1 C15.2 C16.2 C18.2 C19.2 C22.2 C26.2 C27.1 C28.1 C29.1 C30.2 C34.1 C36.1 C37.1 C38.1 C39.1 C40.1 C41.2 C44.1 C45.2 C47.1 CN1.1(-) D1.2(GND) D2.2 LED1.1(K) LED2.1(K) Q1.2(VSS) R1.2 R4.1 R24.1 R27.2 R30.1 U1.1(EH) U1.2(EH) U1.3(EH) U1.4(EH) U1.A1(GND) U1.A12(GND) U1.B1(GND) U1.B12(GND) U2.3(GND) U3.2(V-) U5.3(GND) U6.2(V-) U7.7(GND) U7.9(EP) U9.5(GND) U9.11(EP) U10.2(-Vin) U10.5(-Vo) U13.2(-Vin) U13.5(-Vo) U14.7(GND) U14.9(EP) U17.3 U17.4 U18.4(DGNDU) U18.24(TEST0) U18.26(DGND) X1.2(GND) X1.4(GND)
VBUS: D1.5(VBUS) R13.1 U1.A4(VBUS) U1.A9(VBUS) U1.B4(VBUS) U1.B9(VBUS)
VIN: CN1.2(+) D2.1 Q2.2(D) R26.2 R31.2 U9.1(VIN)
VIN_PROTECTED: C36.2 R22.1 U9.8(VOUT) U10.1(+Vin) U13.1(+Vin)
D+: D1.6(I/O1) R9.1
D-: D1.4(I/O2) R8.1
DN: D1.3(I/O2) U1.A7(DN1) U1.B7(DN2)
DP: D1.1(I/O1) U1.A6(DP1) U1.B6(DP2)
L_MICOUT: C7.2 U2.2(OUT)
L_PAMP_OUT: C23.1 R2.1 U3.4(OUT)
LAMP_IN+: C42.1 U18.16(VOUTL)
LSP+: C45.1 FB4.2 U16.4
LSP-: C44.2 FB3.1 U16.3
R_MICOUT: C17.2 U5.2(OUT)
R_PAMP_OUT: C24.1 R11.1 U6.4(OUT)
RAMP_IN+: C32.1 U18.15(VOUTR)
RSP+: C26.1 FB1.2 U16.2
RSP-: C34.2 FB2.1 U16.1
VBIAS: C8.2 R5.1 R6.1 R7.2 R15.1
XTI: C16.1 R14.2 U18.21(XTI) X1.3
XTO: C19.1 R14.1 U18.20(XTO) X1.1
$1N1209: C27.2 U7.2(BYPASS)
$1N1306: R16.2 U7.3(INP)
$1N1321: FB1.1 U7.8(VOP)
$1N1334: FB2.2 U7.5(VON)
$1N1854: C32.2 R16.1
$1N1856: C33.2 R17.1
$1N1868: R17.2 U7.4(INN)
$1N3774: R1.1 U1.B5(CC2)
$1N3777: R4.2 U1.A5(CC1)
$1N4352: R8.2 U18.2(D-)
$1N4384: C14.2 R13.2 U18.3(VBUS)
$1N4605: R9.2 R10.1 U18.1(D+)
$1N4875: C10.1 R10.2 U18.8(SEL0) U18.9(SEL1) U18.27(VDDI)
$1N5175: C15.1 U18.23(VCCXI)
$1N5194: C18.1 U18.19(VCCP2I)
$1N5215: C22.1 U18.17(VCCP1I)
$1N5735: C20.2 C21.1 U18.10(VCCCI)
$1N5788: C25.1 U18.14(VCOM)
$1N5995: C24.2 U18.13(VINR)
$1N6000: C23.2 U18.12(VINL)
$1N8779: R2.2 R3.1 U3.3(IN-)
$1N9196: C1.2 R3.2
$1N12168: R23.1 R24.2 U9.3(OV)
$1N12172: R23.2 R31.1 U9.2(UV)
$1N14458: Q2.3(S) Q3.3(S)
$1N14462: Q2.1(G) Q3.1(G) R18.2 U9.10(GATE)
$1N14561: C37.2 U9.4(RETRY)
$1N14702: Q3.2(D) R22.2 U9.9(SENSE)
$1N14991: C47.2 R18.1
$1N23337: C7.1 R6.2 U3.1(IN+)
$1N23752: R11.2 R12.1 U6.3(IN-)
$1N23753: C9.2 R12.2
$1N23760: C17.1 R15.2 U6.1(IN+)
$1N26679: R26.1 R27.1 U9.6(SHDN#)
$1N27508: LED1.2(A) R19.2
$1N27617: LED2.2(A) R20.1
$1N42858: C38.2 U14.2(BYPASS)
$1N42862: R29.2 U14.3(INP)
$1N42863: FB4.1 U14.8(VOP)
$1N42864: FB3.2 U14.5(VON)
$1N42868: C42.2 R29.1
$1N42869: C43.2 R28.1
$1N42870: R28.2 U14.4(INN)

Not connected (* = marked no-connect by the designer): Q1 4(NC)*; U1 A8(SBU1)* B8(SBU2)*; U9 7(FAULT#)*; U10 3(CTRL)* 4(TRIM)*; U13 3(CTRL)* 4(TRIM)*; U18 5(HID0)* 6(HID1)* 7(HID2)* 25(TEST1) 28(SSPND#)*

## Notes on the sheet
- USB CONNECTOR & PROTECTIONS
- Microphones + Pre amps
- (around 34 dB gain)
- Left
- LDO: 3.3V Output
- Reference Bias
- Stereo Mic Input + Mono Speaker Output
- USB Stereo CODEC
- Right
- AMP: NS4110B
- Left Channel
- Right Channel
- Reverse Voltage Protection
- 5V Buck
- 13S Li-ion, approx 50V
- UV at 40.6V, OV at 60V
- Max current 10A
- 12V Buck
- Connectors
- Power In
- PWR Indication
- Right Speaker Out
- Raspberry Pi Power
- ASV1 Head
- Left Speaker Out
- 6/8/2026
- 1.0
- aiden lim
- 1
